# Altium schematic sheet DriverAxis.SchDoc
size A
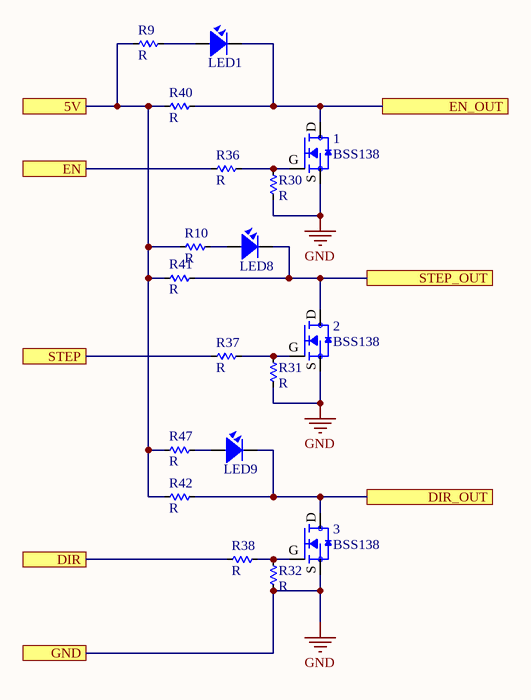
[diagram p0: DriverAxis.SchDoc]

## Parts
1  BSS138  [SOT23-bss138]
2  BSS138  [SOT23-bss138]
3  BSS138  [SOT23-bss138]
LED1  LED  [LED-0805-Blue]  (value not drawn)
LED8  LED  [LED-0805-Blue]  (value not drawn)
LED9  LED  [LED-0805-Blue]  (value not drawn)
R9  R  [RES-SMD-0603_BIG]
R10  R  [RES-SMD-0603_BIG]
R30  R  [RES-SMD-0603_BIG]
R31  R  [RES-SMD-0603_BIG]
R32  R  [RES-SMD-0603_BIG]
R36  R  [RES-SMD-0603_BIG]
R37  R  [RES-SMD-0603_BIG]
R38  R  [RES-SMD-0603_BIG]
R40  R  [RES-SMD-0603_BIG]
R41  R  [RES-SMD-0603_BIG]
R42  R  [RES-SMD-0603_BIG]
R47  R  [RES-SMD-0603_BIG]

## Ports
5V, DIR, DIR_OUT, EN, EN_OUT, GND, STEP, STEP_OUT

## Nets
GND: 1.S 2.S 3.S R30.2 R31.2 R32.2 ; port GND
5V: R9.1 R10.1 R40.1 R41.1 R42.1 R47.1 ; port 5V
DIR: R38.1 ; port DIR
DIR_OUT: 3.D LED9.2 R42.2 ; port DIR_OUT
EN: R36.1 ; port EN
EN_OUT: 1.D LED1.2 R40.2 ; port EN_OUT
STEP: R37.1 ; port STEP
STEP_OUT: 2.D LED8.2 R41.2 ; port STEP_OUT
Net1_G: 1.G R30.1 R36.2
Net2_G: 2.G R31.1 R37.2
Net3_G: 3.G R32.1 R38.2
NetLED1_1: LED1.1 R9.2
NetLED8_1: LED8.1 R10.2
NetLED9_1: LED9.1 R47.2

## Library data of the parts
1-3 = BSS138: N-Channel 50V 220mA _Ta_ 360mW _Ta_ Surface Mount Die; MF: MICROSS/On Semiconductor; Value: *; SnapEDA_Link: https://www.snapeda.com/parts/BSS138/MICROSS/On%20Semiconductor/view-part/2773844/?ref=snap; MP: BSS138; Availability: Unavailable; Price: None; Package: TO-236-3 Micross
LED1 LED8 LED9 = LED SMD: Value: LED 3 - 5 ly 2 Colour